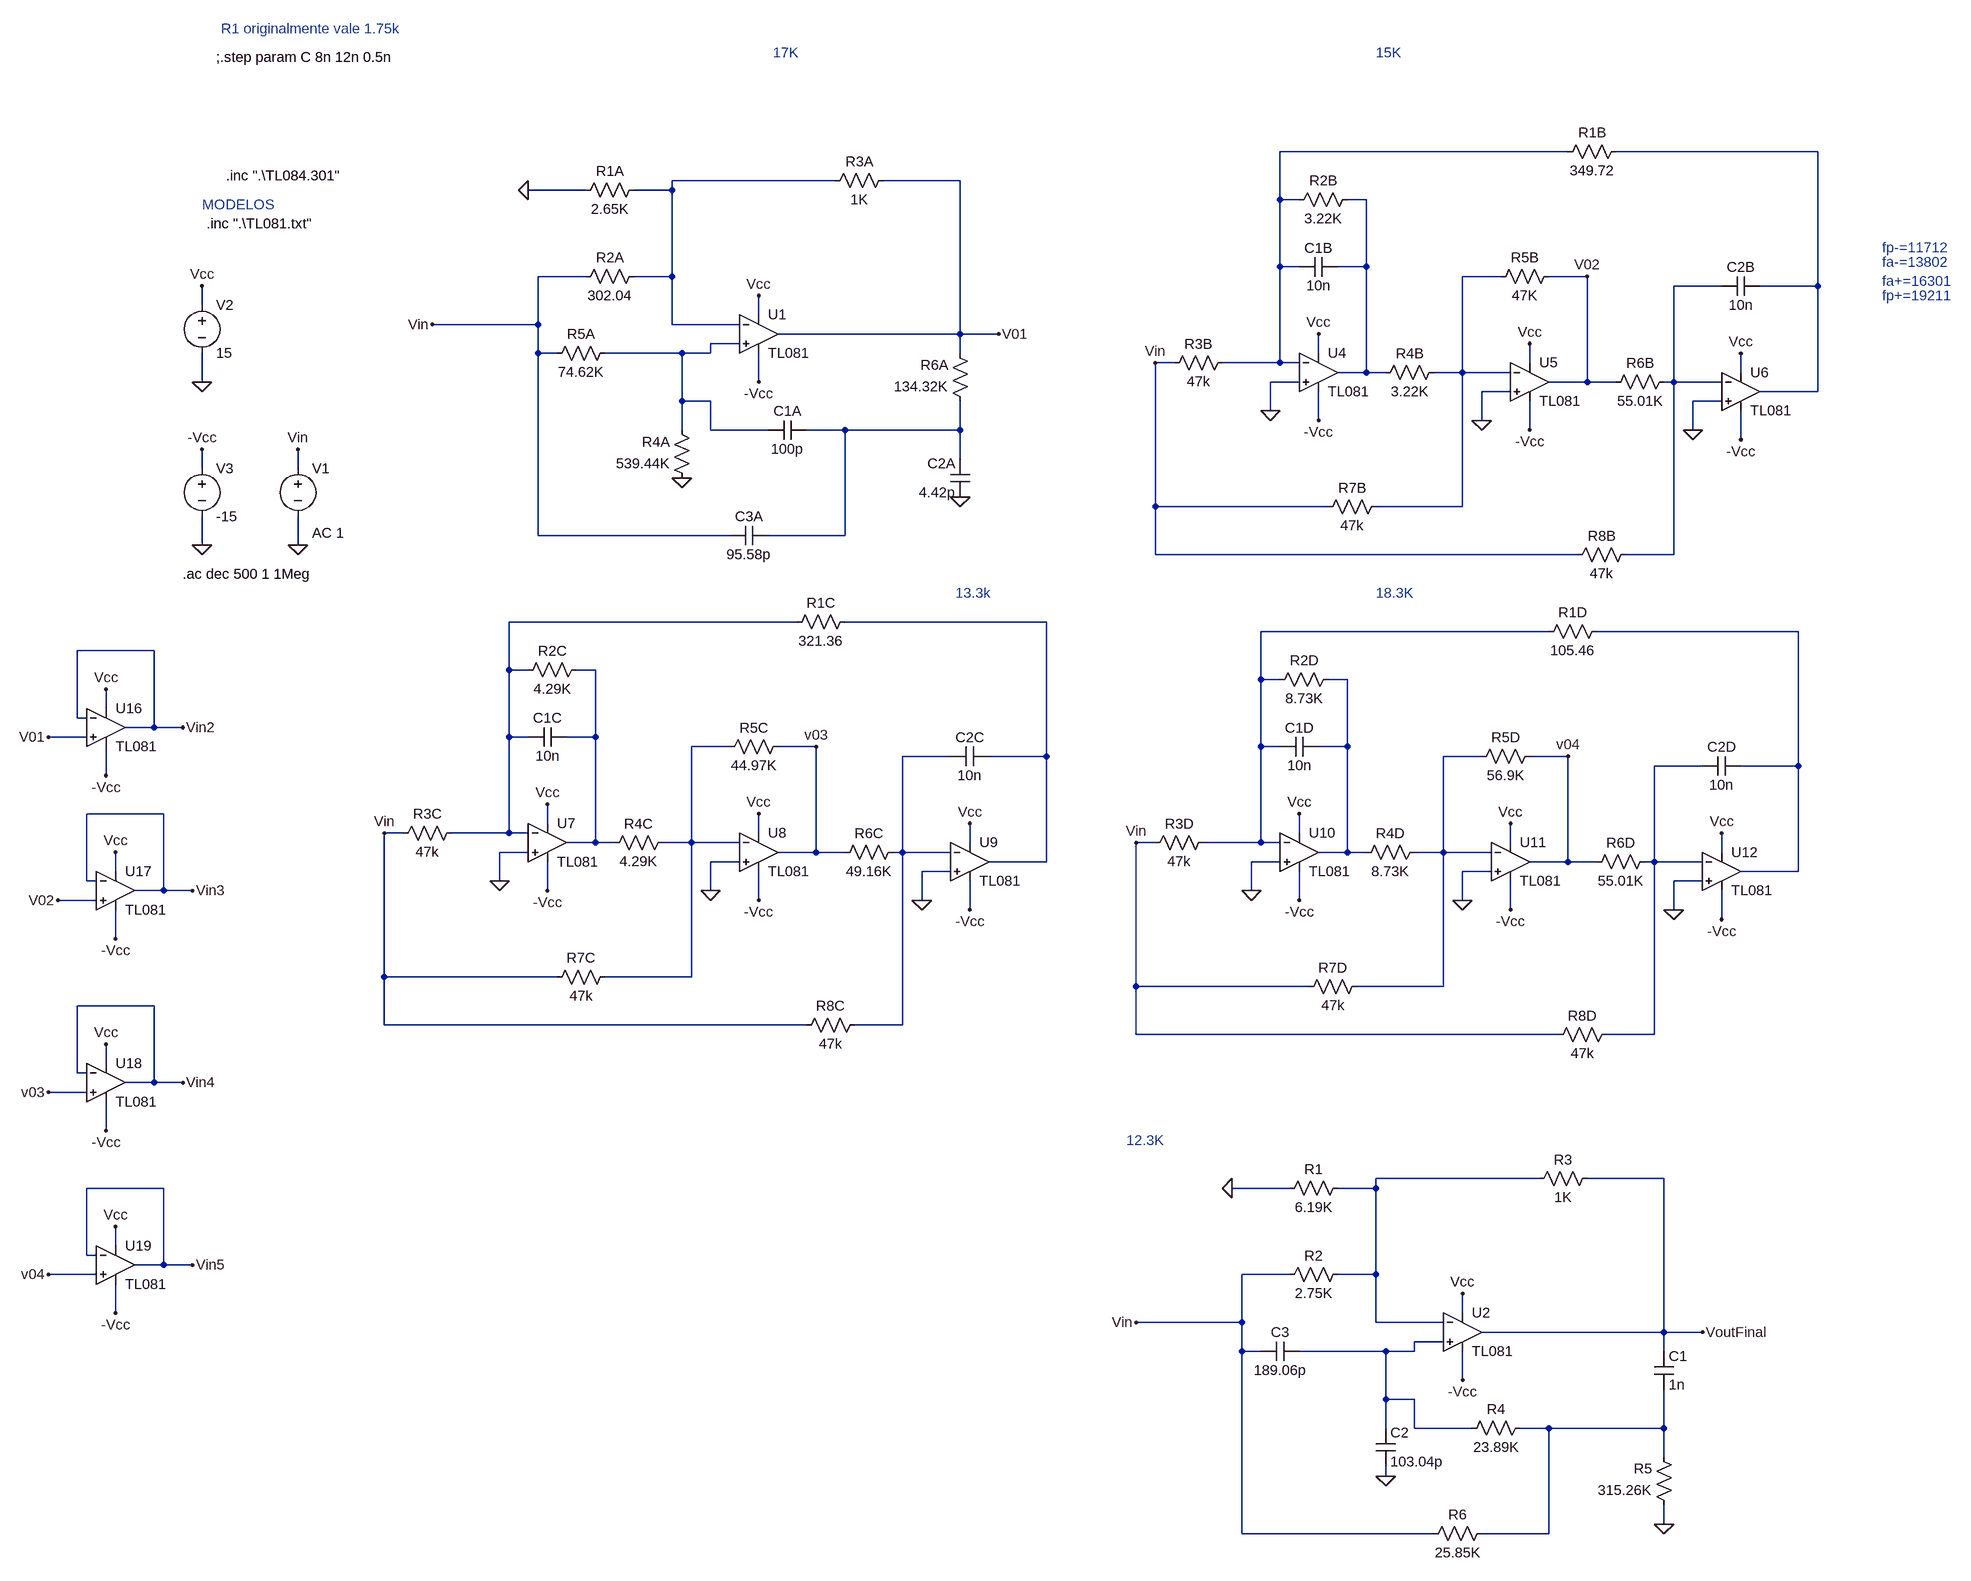
[diagram p0: schematic TPF.asc]
TPF.asc, the LTspice schematic file:
Version 4
SHEET 1 3164 1936
WIRE 2032 -416 1552 -416
WIRE 2448 -416 2112 -416
WIRE 784 -368 512 -368
WIRE 992 -368 864 -368
WIRE 368 -352 272 -352
WIRE 512 -352 512 -368
WIRE 512 -352 448 -352
WIRE 1552 -336 1552 -416
WIRE 1584 -336 1552 -336
WIRE 1696 -336 1664 -336
WIRE 1552 -224 1552 -336
WIRE 1584 -224 1552 -224
WIRE 1696 -224 1696 -336
WIRE 1696 -224 1648 -224
WIRE 368 -208 288 -208
WIRE 512 -208 512 -352
WIRE 512 -208 448 -208
WIRE 1920 -208 1856 -208
WIRE 2064 -208 2000 -208
WIRE 2288 -192 2208 -192
WIRE 2448 -192 2448 -416
WIRE 2448 -192 2352 -192
WIRE -272 -160 -272 -192
WIRE 656 -144 656 -176
WIRE 288 -128 288 -208
WIRE 288 -128 112 -128
WIRE 512 -128 512 -208
WIRE 624 -128 512 -128
WIRE 992 -112 992 -368
WIRE 992 -112 688 -112
WIRE 1056 -112 992 -112
WIRE 624 -96 576 -96
WIRE 288 -80 288 -128
WIRE 320 -80 288 -80
WIRE 528 -80 400 -80
WIRE 576 -80 576 -96
WIRE 576 -80 528 -80
WIRE 992 -80 992 -112
WIRE 1616 -80 1616 -112
WIRE 1376 -64 1344 -64
WIRE 1552 -64 1552 -224
WIRE 1552 -64 1456 -64
WIRE 1584 -64 1552 -64
WIRE 1968 -64 1968 -96
WIRE 1696 -48 1696 -224
WIRE 1696 -48 1648 -48
WIRE 1728 -48 1696 -48
WIRE 1856 -48 1856 -208
WIRE 1856 -48 1808 -48
WIRE 1936 -48 1856 -48
WIRE 2320 -48 2320 -80
WIRE -272 -32 -272 -80
WIRE 656 -32 656 -80
WIRE 1584 -32 1536 -32
WIRE 2064 -32 2064 -208
WIRE 2064 -32 2000 -32
WIRE 2112 -32 2064 -32
WIRE 2208 -32 2208 -192
WIRE 2208 -32 2192 -32
WIRE 2288 -32 2208 -32
WIRE 1936 -16 1888 -16
WIRE 2448 -16 2448 -192
WIRE 2448 -16 2352 -16
WIRE 528 0 528 -80
WIRE 576 0 528 0
WIRE 2288 0 2240 0
WIRE 1536 16 1536 -32
WIRE 1616 32 1616 -16
WIRE 1888 32 1888 -16
WIRE 528 48 528 0
WIRE 576 48 576 0
WIRE 672 48 576 48
WIRE 800 48 736 48
WIRE 992 48 992 0
WIRE 992 48 800 48
WIRE 1968 48 1968 0
WIRE 2240 48 2240 0
WIRE 2320 64 2320 16
WIRE 992 96 992 48
WIRE -272 112 -272 80
WIRE -112 112 -112 80
WIRE 1344 176 1344 -64
WIRE 1632 176 1344 176
WIRE 1856 176 1856 -48
WIRE 1856 176 1712 176
WIRE 288 224 288 -80
WIRE 608 224 288 224
WIRE 800 224 800 48
WIRE 800 224 672 224
WIRE -272 240 -272 192
WIRE -112 240 -112 192
WIRE 1344 256 1344 176
WIRE 2048 256 1344 256
WIRE 2208 256 2208 -32
WIRE 2208 256 2128 256
WIRE 720 368 240 368
WIRE 1136 368 800 368
WIRE 2000 384 1520 384
WIRE 2416 384 2080 384
WIRE -352 416 -480 416
WIRE 240 448 240 368
WIRE 272 448 240 448
WIRE 384 448 352 448
WIRE 1520 464 1520 384
WIRE 1552 464 1520 464
WIRE 1664 464 1632 464
WIRE -432 512 -432 480
WIRE -480 528 -480 416
WIRE -464 528 -480 528
WIRE -352 544 -352 416
WIRE -352 544 -400 544
WIRE -304 544 -352 544
WIRE -464 560 -528 560
WIRE 240 560 240 448
WIRE 272 560 240 560
WIRE 384 560 384 448
WIRE 384 560 336 560
WIRE 608 576 544 576
WIRE 752 576 688 576
WIRE 1520 576 1520 464
WIRE 1552 576 1520 576
WIRE 1664 576 1664 464
WIRE 1664 576 1616 576
WIRE 976 592 896 592
WIRE 1136 592 1136 368
WIRE 1136 592 1040 592
WIRE 1888 592 1824 592
WIRE 2032 592 1968 592
WIRE 2256 608 2176 608
WIRE 2416 608 2416 384
WIRE 2416 608 2320 608
WIRE -432 624 -432 576
WIRE -336 688 -464 688
WIRE 304 704 304 672
WIRE 64 720 32 720
WIRE 240 720 240 560
WIRE 240 720 144 720
WIRE 272 720 240 720
WIRE 656 720 656 688
WIRE 1584 720 1584 688
WIRE 384 736 384 560
WIRE 384 736 336 736
WIRE 416 736 384 736
WIRE 544 736 544 576
WIRE 544 736 496 736
WIRE 624 736 544 736
WIRE 1008 736 1008 704
WIRE 1344 736 1312 736
WIRE 1520 736 1520 576
WIRE 1520 736 1424 736
WIRE 1552 736 1520 736
WIRE 1936 736 1936 704
WIRE 272 752 224 752
WIRE 752 752 752 576
WIRE 752 752 688 752
WIRE 800 752 752 752
WIRE 896 752 896 592
WIRE 896 752 880 752
WIRE 976 752 896 752
WIRE 1664 752 1664 576
WIRE 1664 752 1616 752
WIRE 1696 752 1664 752
WIRE 1824 752 1824 592
WIRE 1824 752 1776 752
WIRE 1904 752 1824 752
WIRE 2288 752 2288 720
WIRE 624 768 576 768
WIRE 1136 768 1136 592
WIRE 1136 768 1040 768
WIRE 1552 768 1504 768
WIRE 2032 768 2032 592
WIRE 2032 768 1968 768
WIRE 2080 768 2032 768
WIRE 2176 768 2176 608
WIRE 2176 768 2160 768
WIRE 2256 768 2176 768
WIRE -416 784 -416 752
WIRE 976 784 928 784
WIRE 1904 784 1856 784
WIRE 2416 784 2416 608
WIRE 2416 784 2320 784
WIRE -464 800 -464 688
WIRE -448 800 -464 800
WIRE 224 800 224 752
WIRE 2256 800 2208 800
WIRE -336 816 -336 688
WIRE -336 816 -384 816
WIRE -288 816 -336 816
WIRE 304 816 304 768
WIRE 576 816 576 768
WIRE 1504 816 1504 768
WIRE -448 832 -512 832
WIRE 656 832 656 784
WIRE 928 832 928 784
WIRE 1584 832 1584 784
WIRE 1856 832 1856 784
WIRE 1008 848 1008 800
WIRE 1936 848 1936 800
WIRE 2208 848 2208 800
WIRE 2288 864 2288 816
WIRE -416 896 -416 848
WIRE 32 960 32 720
WIRE 320 960 32 960
WIRE 544 960 544 736
WIRE 544 960 400 960
WIRE 1312 976 1312 736
WIRE 1600 976 1312 976
WIRE 1824 976 1824 752
WIRE 1824 976 1680 976
WIRE -352 1008 -480 1008
WIRE 32 1040 32 960
WIRE 736 1040 32 1040
WIRE 896 1040 896 752
WIRE 896 1040 816 1040
WIRE 1312 1056 1312 976
WIRE 2016 1056 1312 1056
WIRE 2176 1056 2176 768
WIRE 2176 1056 2096 1056
WIRE -432 1104 -432 1072
WIRE -480 1120 -480 1008
WIRE -464 1120 -480 1120
WIRE -352 1136 -352 1008
WIRE -352 1136 -400 1136
WIRE -304 1136 -352 1136
WIRE -464 1152 -528 1152
WIRE -432 1216 -432 1168
WIRE 1984 1296 1712 1296
WIRE 2192 1296 2064 1296
WIRE -336 1312 -464 1312
WIRE 1568 1312 1472 1312
WIRE 1712 1312 1712 1296
WIRE 1712 1312 1648 1312
WIRE -416 1408 -416 1376
WIRE -464 1424 -464 1312
WIRE -448 1424 -464 1424
WIRE -336 1440 -336 1312
WIRE -336 1440 -384 1440
WIRE -288 1440 -336 1440
WIRE -448 1456 -528 1456
WIRE 1568 1456 1488 1456
WIRE 1712 1456 1712 1312
WIRE 1712 1456 1648 1456
WIRE -416 1520 -416 1472
WIRE 1856 1520 1856 1488
WIRE 1488 1536 1488 1456
WIRE 1488 1536 1312 1536
WIRE 1712 1536 1712 1456
WIRE 1824 1536 1712 1536
WIRE 2192 1552 2192 1296
WIRE 2192 1552 1888 1552
WIRE 2256 1552 2192 1552
WIRE 1824 1568 1776 1568
WIRE 1488 1584 1488 1536
WIRE 1520 1584 1488 1584
WIRE 1728 1584 1584 1584
WIRE 1776 1584 1776 1568
WIRE 1776 1584 1728 1584
WIRE 2192 1584 2192 1552
WIRE 1856 1632 1856 1584
WIRE 1728 1664 1728 1584
WIRE 1776 1664 1728 1664
WIRE 1728 1712 1728 1664
WIRE 1776 1712 1776 1664
WIRE 1872 1712 1776 1712
WIRE 2000 1712 1952 1712
WIRE 2192 1712 2192 1648
WIRE 2192 1712 2000 1712
WIRE 2192 1760 2192 1712
WIRE 1728 1792 1728 1776
WIRE 2192 1872 2192 1840
WIRE 1488 1888 1488 1584
WIRE 1808 1888 1488 1888
WIRE 2000 1888 2000 1712
WIRE 2000 1888 1888 1888
FLAG -272 80 -Vcc
FLAG -272 -192 Vcc
FLAG -272 -32 0
FLAG -272 240 0
FLAG 656 -176 Vcc
FLAG 656 -32 -Vcc
FLAG -112 240 0
FLAG -112 80 Vin
FLAG 112 -128 Vin
FLAG 1616 -112 Vcc
FLAG 1616 32 -Vcc
FLAG 1536 16 0
FLAG 1968 -96 Vcc
FLAG 1968 48 -Vcc
FLAG 1888 32 0
FLAG 2320 -80 Vcc
FLAG 2320 64 -Vcc
FLAG 2240 48 0
FLAG 2064 -208 V02
FLAG 304 672 Vcc
FLAG 304 816 -Vcc
FLAG 224 800 0
FLAG 656 688 Vcc
FLAG 656 832 -Vcc
FLAG 576 816 0
FLAG 1008 704 Vcc
FLAG 1008 848 -Vcc
FLAG 928 832 0
FLAG 1584 688 Vcc
FLAG 1584 832 -Vcc
FLAG 1504 816 0
FLAG 1936 704 Vcc
FLAG 1936 848 -Vcc
FLAG 1856 832 0
FLAG 2288 720 Vcc
FLAG 2288 864 -Vcc
FLAG 2208 848 0
FLAG 752 576 v03
FLAG 2032 592 v04
FLAG -432 480 Vcc
FLAG -432 624 -Vcc
FLAG -416 752 Vcc
FLAG -416 896 -Vcc
FLAG -432 1072 Vcc
FLAG -432 1216 -Vcc
FLAG -528 560 V01
FLAG -304 544 Vin2
FLAG -512 832 V02
FLAG -288 816 Vin3
FLAG -528 1152 v03
FLAG -304 1136 Vin4
FLAG -416 1376 Vcc
FLAG -416 1520 -Vcc
FLAG -528 1456 v04
FLAG -288 1440 Vin5
FLAG 272 -352 0
FLAG 992 160 0
FLAG 528 128 0
FLAG 1856 1488 Vcc
FLAG 1856 1632 -Vcc
FLAG 1472 1312 0
FLAG 1728 1792 0
FLAG 2256 1552 VoutFinal
FLAG 2192 1872 0
FLAG 1056 -112 V01
FLAG 1344 -64 Vin
FLAG 1312 736 Vin
FLAG 32 720 Vin
FLAG 1312 1536 Vin
SYMBOL voltage -272 -176 R0
SYMATTR InstName V2
SYMATTR Value 15
SYMBOL voltage -272 96 R0
SYMATTR InstName V3
SYMATTR Value -15
SYMBOL Opamps\\opamp2 656 -176 R0
SYMATTR InstName U1
SYMATTR Value TL081
SYMBOL voltage -112 96 R0
WINDOW 123 24 124 Left 2
WINDOW 39 0 0 Left 0
SYMATTR Value2 AC 1
SYMATTR InstName V1
SYMATTR Value ""
SYMBOL Opamps\\opamp2 1616 -112 R0
SYMATTR InstName U4
SYMATTR Value TL081
SYMBOL cap 1648 -240 R90
WINDOW 0 0 32 VBottom 2
WINDOW 3 32 32 VTop 2
SYMATTR InstName C1B
SYMATTR Value 10n
SYMBOL res 2128 -432 R90
WINDOW 0 0 56 VBottom 2
WINDOW 3 32 56 VTop 2
SYMATTR InstName R1B
SYMATTR Value 349.72
SYMBOL res 1680 -352 R90
WINDOW 0 0 56 VBottom 2
WINDOW 3 32 56 VTop 2
SYMATTR InstName R2B
SYMATTR Value 3.22K
SYMBOL res 1472 -80 R90
WINDOW 0 0 56 VBottom 2
WINDOW 3 32 56 VTop 2
SYMATTR InstName R3B
SYMATTR Value 47k
SYMBOL res 1824 -64 R90
WINDOW 0 0 56 VBottom 2
WINDOW 3 32 56 VTop 2
SYMATTR InstName R4B
SYMATTR Value 3.22K
SYMBOL res 2016 -224 R90
WINDOW 0 0 56 VBottom 2
WINDOW 3 32 56 VTop 2
SYMATTR InstName R5B
SYMATTR Value 47K
SYMBOL res 2208 -48 R90
WINDOW 0 0 56 VBottom 2
WINDOW 3 32 56 VTop 2
SYMATTR InstName R6B
SYMATTR Value 55.01K
SYMBOL res 1728 160 R90
WINDOW 0 0 56 VBottom 2
WINDOW 3 32 56 VTop 2
SYMATTR InstName R7B
SYMATTR Value 47k
SYMBOL res 2144 240 R90
WINDOW 0 0 56 VBottom 2
WINDOW 3 32 56 VTop 2
SYMATTR InstName R8B
SYMATTR Value 47k
SYMBOL cap 2352 -208 R90
WINDOW 0 0 32 VBottom 2
WINDOW 3 32 32 VTop 2
SYMATTR InstName C2B
SYMATTR Value 10n
SYMBOL Opamps\\opamp2 1968 -96 R0
SYMATTR InstName U5
SYMATTR Value TL081
SYMBOL Opamps\\opamp2 2320 -80 R0
SYMATTR InstName U6
SYMATTR Value TL081
SYMBOL Opamps\\opamp2 304 672 R0
SYMATTR InstName U7
SYMATTR Value TL081
SYMBOL cap 336 544 R90
WINDOW 0 0 32 VBottom 2
WINDOW 3 32 32 VTop 2
SYMATTR InstName C1C
SYMATTR Value 10n
SYMBOL res 816 352 R90
WINDOW 0 0 56 VBottom 2
WINDOW 3 32 56 VTop 2
SYMATTR InstName R1C
SYMATTR Value 321.36
SYMBOL res 368 432 R90
WINDOW 0 0 56 VBottom 2
WINDOW 3 32 56 VTop 2
SYMATTR InstName R2C
SYMATTR Value 4.29K
SYMBOL res 160 704 R90
WINDOW 0 0 56 VBottom 2
WINDOW 3 32 56 VTop 2
SYMATTR InstName R3C
SYMATTR Value 47k
SYMBOL res 512 720 R90
WINDOW 0 0 56 VBottom 2
WINDOW 3 32 56 VTop 2
SYMATTR InstName R4C
SYMATTR Value 4.29K
SYMBOL res 704 560 R90
WINDOW 0 0 56 VBottom 2
WINDOW 3 32 56 VTop 2
SYMATTR InstName R5C
SYMATTR Value 44.97K
SYMBOL res 896 736 R90
WINDOW 0 0 56 VBottom 2
WINDOW 3 32 56 VTop 2
SYMATTR InstName R6C
SYMATTR Value 49.16K
SYMBOL res 416 944 R90
WINDOW 0 0 56 VBottom 2
WINDOW 3 32 56 VTop 2
SYMATTR InstName R7C
SYMATTR Value 47k
SYMBOL res 832 1024 R90
WINDOW 0 0 56 VBottom 2
WINDOW 3 32 56 VTop 2
SYMATTR InstName R8C
SYMATTR Value 47k
SYMBOL cap 1040 576 R90
WINDOW 0 0 32 VBottom 2
WINDOW 3 32 32 VTop 2
SYMATTR InstName C2C
SYMATTR Value 10n
SYMBOL Opamps\\opamp2 656 688 R0
SYMATTR InstName U8
SYMATTR Value TL081
SYMBOL Opamps\\opamp2 1008 704 R0
SYMATTR InstName U9
SYMATTR Value TL081
SYMBOL Opamps\\opamp2 1584 688 R0
SYMATTR InstName U10
SYMATTR Value TL081
SYMBOL cap 1616 560 R90
WINDOW 0 0 32 VBottom 2
WINDOW 3 32 32 VTop 2
SYMATTR InstName C1D
SYMATTR Value 10n
SYMBOL res 2096 368 R90
WINDOW 0 0 56 VBottom 2
WINDOW 3 32 56 VTop 2
SYMATTR InstName R1D
SYMATTR Value 105.46
SYMBOL res 1648 448 R90
WINDOW 0 0 56 VBottom 2
WINDOW 3 32 56 VTop 2
SYMATTR InstName R2D
SYMATTR Value 8.73K
SYMBOL res 1440 720 R90
WINDOW 0 0 56 VBottom 2
WINDOW 3 32 56 VTop 2
SYMATTR InstName R3D
SYMATTR Value 47k
SYMBOL res 1792 736 R90
WINDOW 0 0 56 VBottom 2
WINDOW 3 32 56 VTop 2
SYMATTR InstName R4D
SYMATTR Value 8.73K
SYMBOL res 1984 576 R90
WINDOW 0 0 56 VBottom 2
WINDOW 3 32 56 VTop 2
SYMATTR InstName R5D
SYMATTR Value 56.9K
SYMBOL res 2176 752 R90
WINDOW 0 0 56 VBottom 2
WINDOW 3 32 56 VTop 2
SYMATTR InstName R6D
SYMATTR Value 55.01K
SYMBOL res 1696 960 R90
WINDOW 0 0 56 VBottom 2
WINDOW 3 32 56 VTop 2
SYMATTR InstName R7D
SYMATTR Value 47k
SYMBOL res 2112 1040 R90
WINDOW 0 0 56 VBottom 2
WINDOW 3 32 56 VTop 2
SYMATTR InstName R8D
SYMATTR Value 47k
SYMBOL cap 2320 592 R90
WINDOW 0 0 32 VBottom 2
WINDOW 3 32 32 VTop 2
SYMATTR InstName C2D
SYMATTR Value 10n
SYMBOL Opamps\\opamp2 1936 704 R0
SYMATTR InstName U11
SYMATTR Value TL081
SYMBOL Opamps\\opamp2 2288 720 R0
SYMATTR InstName U12
SYMATTR Value TL081
SYMBOL Opamps\\opamp2 -432 480 R0
SYMATTR InstName U16
SYMATTR Value TL081
SYMBOL Opamps\\opamp2 -416 752 R0
SYMATTR InstName U17
SYMATTR Value TL081
SYMBOL Opamps\\opamp2 -432 1072 R0
SYMATTR InstName U18
SYMATTR Value TL081
SYMBOL Opamps\\opamp2 -416 1376 R0
SYMATTR InstName U19
SYMATTR Value TL081
SYMBOL res 464 -368 R90
WINDOW 0 0 56 VBottom 2
WINDOW 3 32 56 VTop 2
SYMATTR InstName R1A
SYMATTR Value 2.65K
SYMBOL res 880 -384 R90
WINDOW 0 0 56 VBottom 2
WINDOW 3 32 56 VTop 2
SYMATTR InstName R3A
SYMATTR Value 1K
SYMBOL res 464 -224 R90
WINDOW 0 0 56 VBottom 2
WINDOW 3 32 56 VTop 2
SYMATTR InstName R2A
SYMATTR Value 302.04
SYMBOL res 416 -96 R90
WINDOW 0 0 56 VBottom 2
WINDOW 3 32 56 VTop 2
SYMATTR InstName R5A
SYMATTR Value 74.62K
SYMBOL res 544 144 R180
WINDOW 0 36 76 Left 2
WINDOW 3 36 40 Left 2
SYMATTR InstName R4A
SYMATTR Value 539.44K
SYMBOL res 1008 16 R180
WINDOW 0 36 76 Left 2
WINDOW 3 36 40 Left 2
SYMATTR InstName R6A
SYMATTR Value 134.32K
SYMBOL cap 736 32 R90
WINDOW 0 0 32 VBottom 2
WINDOW 3 32 32 VTop 2
SYMATTR InstName C1A
SYMATTR Value 100p
SYMBOL cap 1008 160 R180
WINDOW 0 24 56 Left 2
WINDOW 3 24 8 Left 2
SYMATTR InstName C2A
SYMATTR Value 4.42p
SYMBOL cap 608 240 R270
WINDOW 0 32 32 VTop 2
WINDOW 3 0 32 VBottom 2
SYMATTR InstName C3A
SYMATTR Value 95.58p
SYMBOL Opamps\\opamp2 1856 1488 R0
SYMATTR InstName U2
SYMATTR Value TL081
SYMBOL res 1664 1296 R90
WINDOW 0 0 56 VBottom 2
WINDOW 3 32 56 VTop 2
SYMATTR InstName R1
SYMATTR Value 6.19K
SYMBOL res 2080 1280 R90
WINDOW 0 0 56 VBottom 2
WINDOW 3 32 56 VTop 2
SYMATTR InstName R3
SYMATTR Value 1K
SYMBOL res 1664 1440 R90
WINDOW 0 0 56 VBottom 2
WINDOW 3 32 56 VTop 2
SYMATTR InstName R2
SYMATTR Value 2.75K
SYMBOL res 1968 1696 R90
WINDOW 0 0 56 VBottom 2
WINDOW 3 32 56 VTop 2
SYMATTR InstName R4
SYMATTR Value 23.89K
SYMBOL res 2208 1856 R180
WINDOW 0 36 76 Left 2
WINDOW 3 36 40 Left 2
SYMATTR InstName R5
SYMATTR Value 315.26K
SYMBOL res 1792 1904 R270
WINDOW 0 32 56 VTop 2
WINDOW 3 0 56 VBottom 2
SYMATTR InstName R6
SYMATTR Value 25.85K
SYMBOL cap 1712 1712 R0
SYMATTR InstName C2
SYMATTR Value 103.04p
SYMBOL cap 1584 1568 R90
WINDOW 0 0 32 VBottom 2
WINDOW 3 32 32 VTop 2
SYMATTR InstName C3
SYMATTR Value 189.06p
SYMBOL cap 2176 1584 R0
SYMATTR InstName C1
SYMATTR Value 1n
TEXT -264 -296 Left 2 !.inc ".\\TL081.txt"
TEXT -272 -328 Left 2 ;MODELOS
TEXT -248 -600 Left 2 !;.step param C 8n 12n 0.5n
TEXT -240 -648 Left 2 ;R1 originalmente vale 1.75k
TEXT -304 288 Left 2 !.ac dec 500 1 1Meg
TEXT 680 -608 Left 2 ;17K
TEXT 1712 -608 Left 2 ;15K
TEXT 984 320 Left 2 ;13.3k
TEXT 1712 320 Left 2 ;18.3K
TEXT 1296 1232 Left 2 ;12.3K
TEXT 3016 -256 Left 2 ;fp-=11712
TEXT 3016 -232 Left 2 ;fa-=13802
TEXT 3016 -200 Left 2 ;fa+=16301
TEXT 3016 -176 Left 2 ;fp+=19211
TEXT -232 -376 Left 2 !.inc ".\\TL084.301"

The netlist it stands for:
* TPF.asc
V2 Vcc 0 15
V3 -Vcc 0 -15
XU1 N007 N003 Vcc -Vcc V01 TL081  ; pins In+ In- V+ V- OUT
V1 Vin 0 AC 1
XU4 0 N001 Vcc -Vcc N004 TL081  ; pins In+ In- V+ V- OUT
C1B N004 N001 10n
R1B N002 N001 349.72
R2B N004 N001 3.22K
R3B N001 Vin 47k
R4B N005 N004 3.22K
R5B V02 N005 47K
R6B N006 V02 55.01K
R7B N005 Vin 47k
R8B N006 Vin 47k
C2B N002 N006 10n
XU5 0 N005 Vcc -Vcc V02 TL081  ; pins In+ In- V+ V- OUT
XU6 0 N006 Vcc -Vcc N002 TL081  ; pins In+ In- V+ V- OUT
XU7 0 N009 Vcc -Vcc N013 TL081  ; pins In+ In- V+ V- OUT
C1C N013 N009 10n
R1C N010 N009 321.36
R2C N013 N009 4.29K
R3C N009 Vin 47k
R4C N015 N013 4.29K
R5C v03 N015 44.97K
R6C N016 v03 49.16K
R7C N015 Vin 47k
R8C N016 Vin 47k
C2C N010 N016 10n
XU8 0 N015 Vcc -Vcc v03 TL081  ; pins In+ In- V+ V- OUT
XU9 0 N016 Vcc -Vcc N010 TL081  ; pins In+ In- V+ V- OUT
XU10 0 N011 Vcc -Vcc N014 TL081  ; pins In+ In- V+ V- OUT
C1D N014 N011 10n
R1D N012 N011 105.46
R2D N014 N011 8.73K
R3D N011 Vin 47k
R4D N017 N014 8.73K
R5D v04 N017 56.9K
R6D N018 v04 55.01K
R7D N017 Vin 47k
R8D N018 Vin 47k
C2D N012 N018 10n
XU11 0 N017 Vcc -Vcc v04 TL081  ; pins In+ In- V+ V- OUT
XU12 0 N018 Vcc -Vcc N012 TL081  ; pins In+ In- V+ V- OUT
XU16 V01 Vin2 Vcc -Vcc Vin2 TL081  ; pins In+ In- V+ V- OUT
XU17 V02 Vin3 Vcc -Vcc Vin3 TL081  ; pins In+ In- V+ V- OUT
XU18 v03 Vin4 Vcc -Vcc Vin4 TL081  ; pins In+ In- V+ V- OUT
XU19 v04 Vin5 Vcc -Vcc Vin5 TL081  ; pins In+ In- V+ V- OUT
R1A N003 0 2.65K
R3A V01 N003 1K
R2A N003 Vin 302.04
R5A N007 Vin 74.62K
R4A 0 N007 539.44K
R6A N008 V01 134.32K
C1A N008 N007 100p
C2A 0 N008 4.42p
C3A Vin N008 95.58p
XU2 N020 N019 Vcc -Vcc VoutFinal TL081  ; pins In+ In- V+ V- OUT
R1 N019 0 6.19K
R3 VoutFinal N019 1K
R2 N019 Vin 2.75K
R4 N021 N020 23.89K
R5 0 N021 315.26K
R6 Vin N021 25.85K
C2 N020 0 103.04p
C3 N020 Vin 189.06p
C1 VoutFinal N021 1n
.inc ".\TL081.txt"
* MODELOS
;.step param C 8n 12n 0.5n
* R1 originalmente vale 1.75k
.ac dec 500 1 1Meg
* 17K
* 15K
* 13.3k
* 18.3K
* 12.3K
* fp-=11712
* fa-=13802
* fa+=16301
* fp+=19211
.inc ".\TL084.301"
.backanno
.end